# EAGLE design badger (EAGLE 7.4.0)
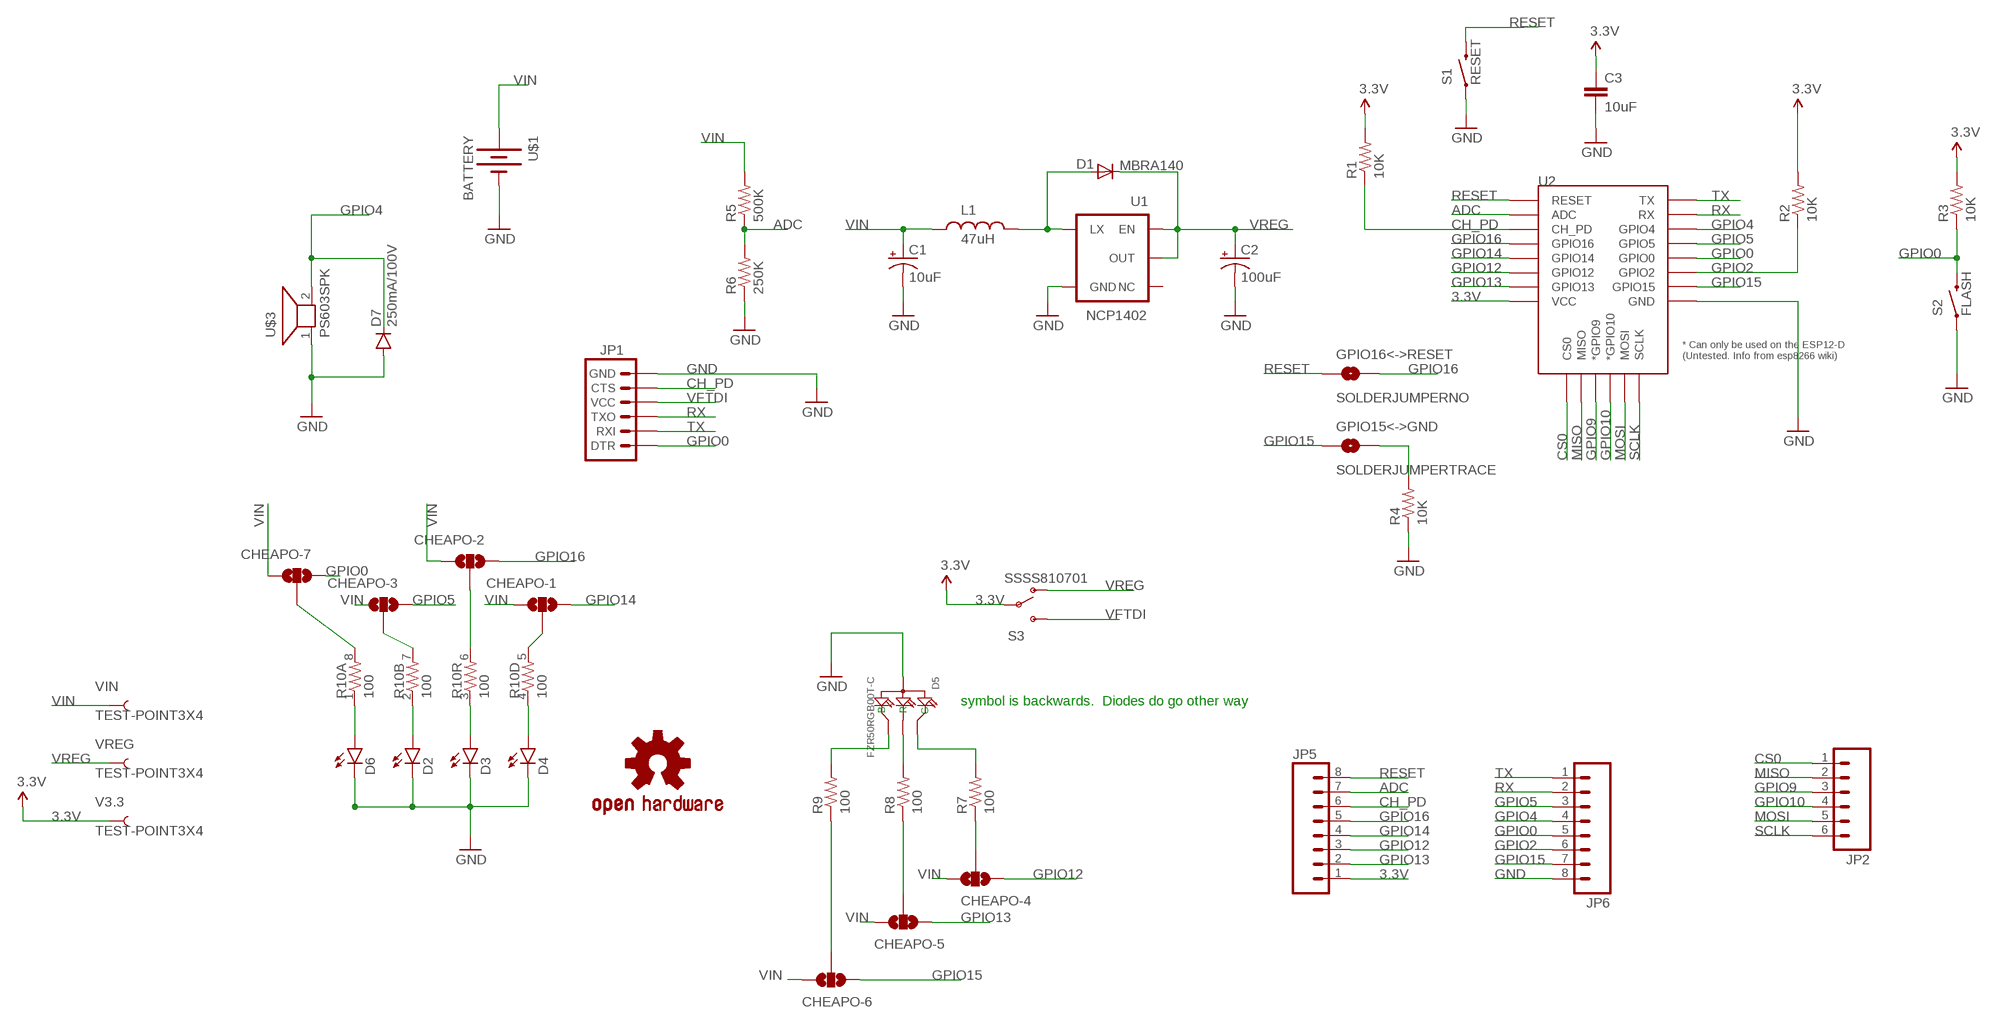
[diagram p0: schematic, sheet 1]

## Parts
C1  10uF  CAP_POL1206  [EIA3216]
C2  100uF  CAP_POL3528  [EIA3528]
C3  10uF  10UF-6.3V-20%(0603)  [0603-CAP]
CHEAPO-1  SOLDERJUMPER_2WAYT  [SJ_2]
CHEAPO-2  SOLDERJUMPER_2WAYT  [SJ_2]
CHEAPO-3  SOLDERJUMPER_2WAYT  [SJ_2]
CHEAPO-4  SOLDERJUMPER_2WAYT  [SJ_2]
CHEAPO-5  SOLDERJUMPER_2WAYT  [SJ_2]
CHEAPO-6  SOLDERJUMPER_2WAYT  [SJ_2]
CHEAPO-7  SOLDERJUMPER_2WAYT  [SJ_2]
D1  MBRA140  DIODESMA  [SMA-DIODE]
D2  LED-3MM-NO_SILK  [LED3MM-NS]
D3  LED-3MM-NO_SILK  [LED3MM-NS]
D4  LED-3MM-NO_SILK  [LED3MM-NS]
D5  FZR50RGB00T-C  DIP-LED-RGB-COMMON-ANODE(4P-D5MM)  [LED4-1.3-D5.0MM]
D6  LED-3MM-NO_SILK  [LED3MM-NS]
D7  250mA/100V  DIODEBAS16  [SOD-323]
GPIO15<->GND  SOLDERJUMPERTRACE  [SJ_2S-TRACE]
GPIO16<->RESET  SOLDERJUMPERNO  [SJ_2S-NO]
JP1  ARDUINO_SERIAL_PROGRAMLOCK  [1X06_LOCK]
JP2  M06LOCK  [1X06_LOCK]
JP5  M08LOCK  [1X08_LOCK]
JP6  M08LOCK  [1X08_LOCK]
L1  47uH  INDUCTORCR54  [CR54]
LOGO1  OSHW-LOGOL-COPPER  [OSHW-LOGO-L_COPPER]
R1  10K  10KOHM-1/10W-1%(0603)0603  [0603-RES]
R2  10K  10KOHM-1/10W-1%(0603)0603  [0603-RES]
R3  10K  10KOHM-1/10W-1%(0603)0603  [0603-RES]
R4  10K  10KOHM-1/10W-1%(0603)0603  [0603-RES]
R5  500K  RESISTOR0603  [0603-RES]
R6  250K  RESISTOR0603  [0603-RES]
R7  100  RESISTOR1206  [1206]
R8  100  RESISTOR1206  [1206]
R9  100  RESISTOR1206  [1206]
R10  100  RESISTOR-ARRAY0603-ARV  [0603-ARV]
S1  RESET  SWITCH-MOMENTARY-2SMD  [TACTILE-SWITCH-SMD]
S2  FLASH  SWITCH-MOMENTARY-2SMD  [TACTILE-SWITCH-SMD]
S3  SSSS810701  [SSSS8]
U1  NCP1402  V_REG_NCP1400SOT23-5  [SOT23-5]
U2  ESP12ESMD  [ESP12E-SMD]
U$1  BATTERY  [HOLDER]
U$3  PS603SPK  [PS603]
V3.3  TEST-POINT3X4  [PAD.03X.04]
VIN  TEST-POINT3X4  [PAD.03X.04]
VREG  TEST-POINT3X4  [PAD.03X.04]

## Nets
3.3V: C3.1 JP5.1 R1.2 R2.2 R3.2 S3.P$2(P) U2.VCC V3.3.P$1
ADC: JP5.7 R5.1 R6.2 U2.ADC
CH_PD: JP1.5(CTS) JP5.6 R1.1 U2.CH_PD
CS0: JP2.1 U2.CS0
GND: C1.C(-) C2.C(-) C3.2 D2.K(C) D3.K(C) D4.K(C) D5.C(+) D6.K(C) D7.A JP1.6(GND) JP6.8 R4.1 R6.1 S1.1 S2.1 U1.4(GND) U2.GND U$1.P$2(-) U$3.1
GPIO0: CHEAPO-7.3 JP1.1(DTR) JP6.5 R3.1 S2.3 U2.GPIO0
GPIO2: JP6.6 R2.1 U2.GPIO2
GPIO4: D7.C JP6.4 U2.GPIO4 U$3.2
GPIO5: CHEAPO-3.3 JP6.3 U2.GPIO5
GPIO9: JP2.3 U2.GPIO9(*GPIO9)
GPIO10: JP2.4 U2.GPIO10(*GPIO10)
GPIO12: CHEAPO-4.1 JP5.3 U2.GPIO12
GPIO13: CHEAPO-5.1 JP5.2 U2.GPIO13
GPIO14: CHEAPO-1.3 JP5.4 U2.GPIO14
GPIO15: CHEAPO-6.1 GPIO15<->GND.1 JP6.7 U2.GPIO15
GPIO16: CHEAPO-2.3 GPIO16<->RESET.2 JP5.5 U2.GPIO16
MISO: JP2.2 U2.MISO
MOSI: JP2.5 U2.MOSI
N$1: GPIO15<->GND.2 R4.2
N$2: D5.R R8.2
N$3: D1.A L1.P$2 U1.5(LX)
N$4: D5.G R7.2
N$5: D2.A R10.2
N$6: D3.A R10.3
N$7: D4.A R10.4
N$8: D5.B R9.2
N$9: CHEAPO-4.2 R7.1
N$11: D6.A R10.1
N$12: CHEAPO-5.2 R8.1
N$13: CHEAPO-3.2 R10.7
N$14: CHEAPO-2.2 R10.6
N$15: CHEAPO-1.2 R10.5
N$16: CHEAPO-7.2 R10.8
N$17: CHEAPO-6.2 R9.1
RESET: GPIO16<->RESET.1 JP5.8 S1.3 U2.RESET
RX: JP1.3(TXO) JP6.2 U2.RXD0(RX)
SCLK: JP2.6 U2.SCLK
TX: JP1.2(RXI) JP6.1 U2.TXD0(TX)
VFTDI: JP1.4(VCC) S3.P$1(S)
VIN: C1.A(+) CHEAPO-1.1 CHEAPO-2.1 CHEAPO-3.1 CHEAPO-4.3 CHEAPO-5.3 CHEAPO-6.3 CHEAPO-7.1 L1.P$1 R5.2 U$1.P$1(+) VIN.P$1
VREG: C2.A(+) D1.C S3.P$3(O) U1.1(EN) U1.2(OUT) VREG.P$1
Unconnected: U1.3(NC)

## Notes on the sheet
- symbol is backwards.  Diodes do go other way

## Library data of the parts
C1 C2 = SparkFun:CAP_POL: Capacitor Polarized These are standard SMD and PTH capacitors. Normally 10uF, 47uF, and 100uF in electrolytic and tantalum varieties. Always verify the external diameter of the through hole cap, it varies with capacity, voltage, and manufacturer. The EIA devices should be standard.
C3 = SparkFun-Capacitors:10UF-6.3V-20%(0603): CAP-11015; PROD_ID: CAP-11015
CHEAPO-1-CHEAPO-7 = SparkFun-Retired:SOLDERJUMPER_2WAY: Solder Jumper 2 way solder jumper
D1 = SparkFun:DIODE: Diode These are standard reverse protection diodes and small signal diodes. SMA package can handle up to about 1A. SOD-323 can handle about 200mA. What the SOD-323 package when ordering, there are some mfgs out there that are 5-pin packages.
D2-D4 D6 = SparkFun-LED:LED: LEDs Standard schematic elements and footprints for 5mm, 3mm, 1206, and 0603 sized LEDs. 5mm - Spark Fun Electronics SKU : COM-00529 (and others)
D5 = Seeed-OPL-Diode:DIP-LED-RGB-COMMON-ANODE(4P-D5MM): 304090056; MPN: FZR50RGB00T-C
D7 = SparkFun-DiscreteSemi:DIODE: Diode These are standard reverse protection diodes and small signal diodes. SMA package can handle up to about 1A. SOD-323 can handle about 200mA. What the SOD-323 package when ordering, there are some mfgs out there that are 5-pin packages.; PROD_ID: DIO-09646
GPIO15<->GND GPIO16<->RESET = SparkFun-Retired:SOLDERJUMPER: Solder Jumper Standard SMD solder jumper. Used to automate production. Two varients : Normally Open and Normally Closed are the same, but have different paste layers. NC will have a large amount of paste and should jumper during reflow.
JP1 = SparkFun-Connectors:ARDUINO_SERIAL_PROGRAM: FTDI connector footprints
JP2 = SparkFun-Connectors:M06: Header 6 Standard 6-pin 0.1" header. Use with straight break away headers (SKU : PRT-00116), right angle break away headers (PRT-00553), swiss pins (PRT-00743), machine pins (PRT-00117), and female headers (PRT-00115). Molex polarized connector foot print use with SKU : PRT-08094 with associated crimp pins and housings. NOTES ON THE VARIANTS LOCK and LOCK_LONGPADS... This footprint was designed to help hold the alignment of a through-hole component (i.e. 6-pin header) while soldering it into place. You may notice that each hole has been shifted either up or down by 0.005 of an inch from it's more standard position (which is a perfectly straight line). This slight alteration caused the pins (the squares in the middle) to touch the edges of the holes. Because they are alternating, it causes a "brace" to hold the component in place. 0.005 has proven to be the perfect amount of "off-center" position when using our standard breakaway headers. Although looks a little odd when you look at the bare footprint, once you have a header in there, the alteration is very hard to notice. Also,if you push a header all the way into place, it is covered up entirely on the bottom side. This idea of altering the position of holes to aid alignment will be further integrated into the Sparkfun Library for other footprints. It can help hold any component with 3 or more connection pins.
JP5 JP6 = SparkFun-Connectors:M08: Header 8 Standard 8-pin 0.1" header. Use with straight break away headers (SKU : PRT-00116), right angle break away headers (PRT-00553), swiss pins (PRT-00743), machine pins (PRT-00117), and female headers (PRT-00115).
L1 = SparkFun:INDUCTOR: Inductors Basic Inductor/Choke - 0603 and 1206. Footprints are not proven and vary greatly between part numbers.
LOGO1 = SparkFun-Aesthetics:OSHW-LOGO: Open Source Hardware Logo This logo indicates the piece of hardware it is found on incorporates a OSHW license and/or adheres to the definition of open source hardware found here: http://freedomdefined.org/OSHW
R1-R4 = SparkFun-Resistors:10KOHM-1/10W-1%(0603): RES-00824; PROD_ID: RES-00824
R5-R9 = SparkFun-Resistors:RESISTOR: Resistor Basic schematic elements and footprints for 0603, 1206, and PTH resistors.
R10 = SparkFun-Resistors:RESISTOR-ARRAY: Array Chip Resistor Source: RS Component / Phycomp
S1 S2 = SparkFun-Electromechanical:SWITCH-MOMENTARY-2: Various NO switches- pushbuttons, reed, etc; PROD_ID: SWCH-08247
S3 = badger:SSSS810701: ALSP SSSS810701
U1 = SparkFun:V_REG_NCP1400: Switching step-up voltage regulator NCP1400 switiching regulator takes single cell AA and outputs 100mA at 3.3V or 5V with minimal number of external components.
U2 = esp8266modules:ESP12E: ESP12E Module
U$1 = badger:BATTERY
U$3 = adafruit:PS603: PS603 Small 8 ohm speaker, from Mouser. Can SMT solder to board http://www.ladyada.net/library/pcb/eaglelibrary.html
V3.3 VIN VREG = SparkFun-Passives:TEST-POINT: Bare copper test points for troubleshooting or ICT

## Board
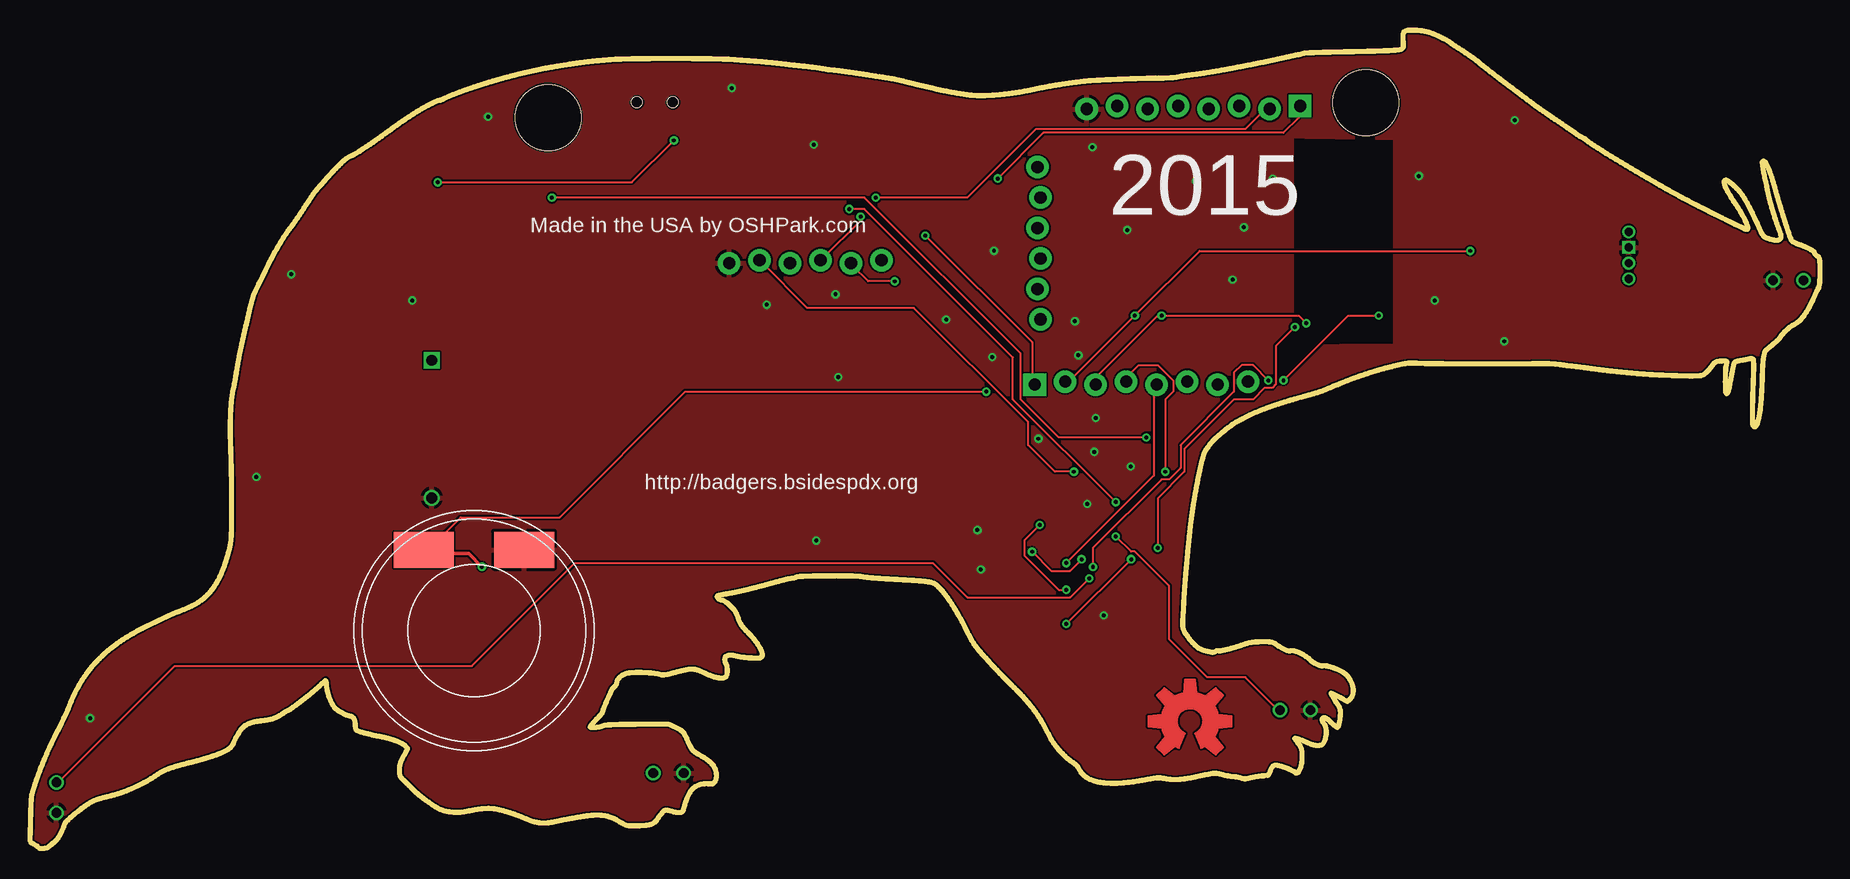
[diagram p1: board, top side]
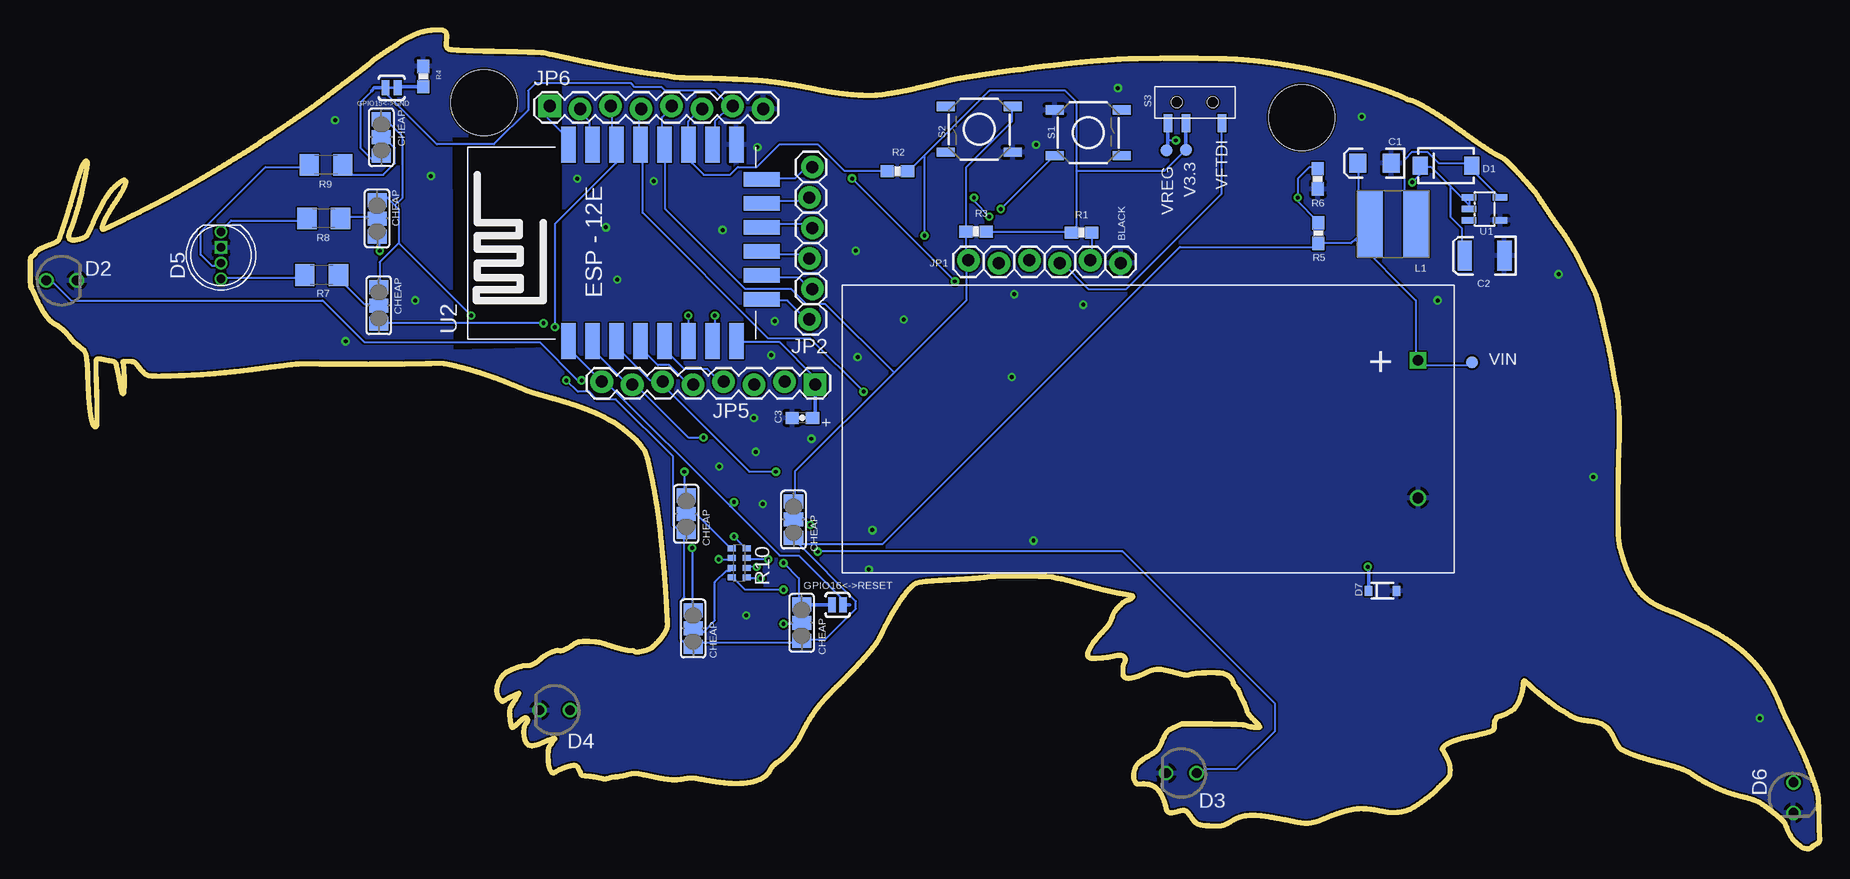
[diagram p2: board, bottom side, seen from below]

Size 149.15 x 68.26 mm. Coordinates in mm from the lower left corner, seen from the top.
Outline: 5234 segments
Copper layers (1*16): Top 0.0356mm / dielectric 1.5011mm / Bottom 0.0356mm
Design rules "oshpark-2layer *": minimum track width 6mil, minimum drill 13mil, track to track 6mil, track to pad 6mil, pad to pad 6mil, via to via 6mil, smd to smd 6mil, copper to edge 6mil, drill to drill 6mil, minimum pad ring 7mil, minimum via ring 7mil, stop-mask expansion 4mil, vias tented up to drill 25mil, thermal gap 10mil
Holes 5.5 mm at 43.18,60.96 111.31,62.2

### Footprints (pad centres in the part's own frame; a part is rotated, then mirrored left to right if it is on the bottom)
EIA3216 = smd 1.4 x 1.6: A 1.4,0; C -1.4,0
EIA3528 = smd 1.2 x 2.5: A 1.65,0; C -1.65,0
0603-CAP = smd 1.1 x 1: 1 -0.85,0; 2 0.85,0
SJ_2 = smd 1.168 x 1.6: 1 -1.524,0; 2 0,0; 3 1.524,0
SMA-DIODE = smd 1.27 x 1.47: A -2.15,0; C 2.15,0
LED3MM-NS = drill 0.813: A -1.27,0; K 1.27,0
LED4-1.3-D5.0MM = drill 0.7 pad 1: B -0.65,0; G -1.95,0; R 1.95,0 | drill 0.7 pad 1 square: C 0.65,0
SOD-323 = smd 0.63 x 0.83: A 1.15,0; C -1.15,0
SJ_2S-TRACE = smd 0.635 x 1.27: 1 -0.508,0; 2 0.508,0
SJ_2S-NO = smd 0.635 x 1.27: 1 -0.45,0; 2 0.45,0
1X06_LOCK = drill 1.016 pad 1.88: 1 0,0; 2 2.54,-0.254; 3 5.08,0; 4 7.62,-0.254; 5 10.16,0; 6 12.7,-0.254
1X08_LOCK = drill 1.016 pad 1.88 square: 1 0,0.127 | drill 1.016 pad 1.88: 2 2.54,-0.127; 3 5.08,0.127; 4 7.62,-0.127; 5 10.16,0.127; 6 12.7,-0.127; 7 15.24,0.127; 8 17.78,-0.127
CR54 = smd 5.5 x 2.15: P$1 0,1.92; P$2 0,-1.92
0603-RES = smd 1.1 x 1: 1 -0.85,0; 2 0.85,0
1206 = smd 1.6 x 1.8: 1 -1.4,0; 2 1.4,0
0603-ARV = smd 0.5 x 0.65: 1 -1.2,-0.625; 2 -0.4,-0.625; 3 0.4,-0.625; 4 1.2,-0.625; 5 1.2,0.625; 6 0.4,0.625; 7 -0.4,0.625; 8 -1.2,0.625
TACTILE-SWITCH-SMD = smd 1.524 x 0.762: 1 -2.794,1.905; 2 2.794,1.905; 3 -2.794,-1.905; 4 2.794,-1.905
SSSS8 = smd 0.7 x 1.5: P$1 -2.25,1.75; P$2 0.75,1.75; P$3 2.25,1.75 | hole 0.9: -1.5,0; 1.5,0
SOT23-5 = smd 0.55 x 1.2: 1 -0.95,-1.3; 2 0,-1.3; 3 0.95,-1.3; 4 0.95,1.3; 5 -0.95,1.3
ESP12E-SMD = smd 3 x 1.2: ADC -8.3,3.8; CH_PD -8.3,1.8; GND 8.1,-8.2; GPIO0 8.1,-2.2; GPIO2 8.1,-4.2; GPIO4 8.1,-0.2; GPIO5 8.1,1.8; GPIO12 -8.3,-4.2; GPIO13 -8.3,-6.2; GPIO14 -8.3,-2.2; GPIO15 8.1,-6.2; GPIO16 -8.3,-0.2; RESET -8.3,5.8; RXD0 8.1,3.8; TXD0 8.1,5.8; VCC -8.3,-8.2 | smd 1.2 x 3: CS0 -4.8,-10.3; GPIO9 -0.8,-10.3; GPIO10 1.2,-10.3; MISO -2.8,-10.3; MOSI 3.2,-10.3; SCLK 5.2,-10.3
HOLDER = drill 0.9 square: P$1 3,6.265 | drill 0.9: P$2 3,17.735
PS603 = smd 5 x 3: 1 -4.184,-6.738; 2 4.184,-6.738
PAD.03X.04 = smd 1.016 x 1.016: P$1 0,0

### Placement (x,y rotation side)
C1  37.12,57.16 180 bottom
C2  27.94,49.43 180 bottom
C3  84.79,35.92 180 bottom
CHEAPO-1  94.47,27.92 90 bottom
CHEAPO-2  84.84,18.84 90 bottom
CHEAPO-3  93.89,18.35 90 bottom
CHEAPO-4  120.09,45.3 90 bottom
CHEAPO-5  120.22,52.55 90 bottom
CHEAPO-6  119.88,59.31 90 bottom
CHEAPO-7  85.52,27.43 90 bottom
D1  31.16,56.96 180 bottom
D2  146.53,47.38 0 bottom
D3  53.2,6.3 180 bottom
D4  105.43,11.55 180 bottom
D5  133.23,49.48 90 bottom
D6  2.2,4.26 270 bottom
D7  36.44,21.5 0 bottom
GPIO15<->GND  119.02,63.44 0 bottom
GPIO16<->RESET  81.86,20.32 180 bottom
JP1  70.96,49.07 0 bottom
JP2  84.21,44.13 90 bottom
JP5  83.73,38.82 180 bottom
JP6  105.84,61.81 0 bottom
L1  35.56,52.07 90 bottom
LOGO1  96.67,10.62 0 top
R1  61.52,51.38 180 bottom
R2  76.87,56.49 0 bottom
R3  70.3,51.47 0 bottom
R4  116.39,64.38 270 bottom
R5  41.8,51.33 270 bottom
R6  41.83,55.86 90 bottom
R7  124.85,47.83 180 bottom
R8  124.68,52.56 180 bottom
R9  124.48,57.02 180 bottom
R10  90.06,23.83 90 bottom
S1  60.96,59.69 0 bottom
S2  70.04,59.98 180 bottom
S3  52.07,62.23 180 bottom
U1  27.94,53.34 270 bottom
U2  98.48,50.61 90 bottom
U$1  30.48,46.99 180 bottom
U$3  36.99,18.18 180 top
V3.3  52.82,58.27 0 bottom
VIN  28.97,40.54 0 bottom
VREG  54.46,58.22 0 bottom

### Tracks (layer width: path | path; a pad name or v marks a point on that pad's centre or on a via)
3.3V  (via drill 0.33)
  Top 0.152: v74.61,51.12 83.5,42.23 83.5,38.73 JP5.1
  Bottom 0.152: U2.VCC 90.17,42.23 86.68,42.23 83.82,39.37 83.82,38.73 JP5.1 | R3.2 69.22,51.44 62.55,51.44 R1.2 62.23,51.44 61.91,51.75 61.91,56.52 | 74.61,57.78 69.22,63.18 62.87,63.18 61.91,62.23 61.91,56.52 | 74.61,57.78 75.88,56.52 R2.2 | 61.91,56.52 54.61,56.52 53.02,58.1 V3.3.P$1 | 74.61,57.78 v74.61,51.12
  Bottom 0.305: S3.P$2 V3.3.P$1 | JP5.1 83.73,36.14 C3.1
ADC  (via drill 0.33)
  Top 0.152: v43.5,54.29 69.53,54.29 82.55,41.27 82.55,37.47 85.72,34.29 v93.03,34.29
  Bottom 0.152: R5.1 41.91,52.39 43.5,53.98 v43.5,54.29 43.5,55.88 42.55,56.83 41.91,56.83 R6.2 | v93.03,34.29 94.3,34.29 98.74,38.73 JP5.7 99.06,38.42 102.23,41.59 102.23,42.23 U2.ADC
CH_PD  (via drill 0.33)
  Top 0.152: v87,31.43 85.41,31.43 83.19,33.66 83.19,35.56 73.66,45.09 64.77,45.09 60.96,48.9 JP1.5
  Bottom 0.152: R1.1 60.64,51.12 60.64,49.21 JP1.5 | U2.CH_PD 100.01,42.23 100.01,41.59 97.47,39.05 96.52,39.05 JP5.6 96.52,38.73 89.22,31.43 v87,31.43
CS0
  Bottom 0.152: U2.CS0 87.95,45.72 86.04,45.72 84.45,44.13 JP2.1
GND  (via drill 0.33)
  other vias: 5.01,10.89 18.87,30.99 21.77,47.89 31.86,45.72 38.17,61.03 58.49,63.42 65.31,58.71 80.33,49.85 67.13,46.23 61.39,45.35 76.34,44.12 80.19,41 87.08,43.98 87.08,43.98 87.37,41.15 100.22,47.46 101.16,51.81 91.44,51.6 88.53,58.49 97.17,55.66 103.55,55.88 115.75,56.09 123.73,60.74 117.05,45.72 122.86,42.31 88.82,35.92 61.39,45.35 65.53,25.69 78.95,26.56 79.24,23.29 88.1,28.74 91.73,31.86 88.68,33.09 84.03,34.18 89.48,19.45 67.34,39.33
  pour Bottom: -5.99,79.57 -5.99,-12.07 114.92,-12.07 114.92,34.38 104.59,34.38 104.59,68.08 15.93,68.08 15.74,79.96
  pour Bottom: 102.67,70.31 103.19,59.51 114.18,59.48 114.09,41.45 106.9,41.62 103.52,42.15 104.39,39.69 104.39,29.84 152.78,29.84 152.78,66.15
  pour Top: -10.04,76 105.14,71.68 105.06,33 117.04,32.83 117.04,-9.75 -24.82,-9.75 -24.82,72.14 -10.04,72.14
  pour Top: 102.08,77.84 103.46,77.5 103.71,59.46 113.76,59.29 113.76,41.91 104.48,41.83 104.48,30.82 152,30.9 152,78.13 109.51,78.13 109.51,83.53 102.08,83.53
GPIO0
  Bottom 0.152: JP6.5 95.57,61.91 96.52,60.96 96.52,58.74 U2.GPIO0 96.2,58.42 96.2,53.34 89.53,46.67 85.72,46.67 84.45,45.4 82.87,45.4 77.15,39.69 | S2.3 67.31,61.59 67.31,60.64 71.12,56.83 71.12,51.75 R3.1 71.12,51.44 71.12,49.21 JP1.1 71.12,48.9 71.12,45.72 77.15,39.69 | 77.15,39.69 85.41,31.43 85.41,29.21 CHEAPO-7.3
GPIO2
  Bottom 0.152: R2.1 77.79,56.52 81.28,56.52 83.5,58.74 86.68,58.74 88.58,56.83 90.17,56.83 90.81,56.2 93.03,56.2 93.98,57.15 93.98,58.42 U2.GPIO2 94.3,58.74 94.3,60.64 93.34,61.59 JP6.6
GPIO4  (via drill 0.33)
  Top 0.152: v79.69,38.1 54.61,38.1 44.13,27.62 35.88,27.62 33.52,25.26 33.02,24.77 U$3.2
  Top 0.305: 34.25,24.53 34.18,24.6 | 33.52,25.26 33.96,24.82 34.18,24.6 | v37.66,23.51 36.57,24.6 34.18,24.6
  Bottom 0.152: JP6.4 98.42,61.59 98.42,58.74 U2.GPIO4 98.11,58.42 98.11,53.02 87.63,42.55 84.14,42.55 v79.69,38.1
  Bottom 0.305: D7.C 37.59,23.44 v37.66,23.51
GPIO5  (via drill 0.33)
  Top 0.152: v93.98,25.08 93.98,29.21 96.2,31.43 96.2,33.34 100.33,37.47 101.92,37.47 102.87,38.42 103.5,38.42 103.82,38.73 103.82,41.91 v105.41,43.5
  Bottom 0.152: v93.98,25.08 93.98,20 CHEAPO-3.3 | v105.41,43.5 105.41,52.07 100.33,57.15 100.33,58.42 U2.GPIO5 100.33,58.74 100.65,59.05 100.65,61.91 JP6.3
GPIO9
  Bottom 0.152: U2.GPIO9 87.95,49.53 84.45,49.53 JP2.3
GPIO10
  Bottom 0.152: U2.GPIO10 87.95,52.07 84.14,52.07 JP2.4
GPIO12  (via drill 0.33)
  Top 0.152: v106.36,43.81 105.73,44.45 v94.3,44.45 93.98,44.45 88.9,39.37 88.9,38.73 JP5.3
  Bottom 0.152: v106.36,43.81 120.02,43.81 CHEAPO-4.1 | v94.3,44.45 94.3,42.55 U2.GPIO12
GPIO13  (via drill 0.33)
  Top 0.152: v120.02,49.85 97.47,49.85 v92.08,44.45 86.36,38.73 JP5.2
  Bottom 0.152: v120.02,49.85 120.02,50.8 CHEAPO-5.1 | v92.08,44.45 92.08,42.55 U2.GPIO13
GPIO14  (via drill 0.33)
  Top 0.152: v94.61,31.43 94.61,37.47 95.25,38.1 95.25,39.05 93.98,40.32 92.39,40.32 91.12,39.05 JP5.4
  Bottom 0.152: v94.61,31.43 94.61,29.53 CHEAPO-1.3 | U2.GPIO14 96.2,42.23 96.2,41.59 94.61,40.01 92.71,40.01 91.44,38.73 JP5.4
GPIO15
  Bottom 0.152: 120.68,63.21 120.65,63.18 121.6,62.23 121.6,58.42 120.65,57.47 120.02,57.47 CHEAPO-6.1 | 90.81,61.91 92.08,60.64 92.08,58.74 U2.GPIO15 | 90.81,61.91 92.08,63.18 96.2,63.18 96.52,63.5 98.74,63.5 99.06,63.82 107,63.82 107.63,63.18 107.63,61.59 110.49,58.74 115.25,58.74 119.7,63.18 GPIO15<->GND.1 | 90.81,61.91 JP6.7
  Bottom 0.305: GPIO15<->GND.1 120.44,63.44 120.68,63.21
GPIO16  (via drill 0.33)
  Top 0.152: v86.36,23.81 93.66,31.11 93.66,38.42 JP5.5
  Bottom 0.152: v86.36,23.81 85.09,22.54 85.09,20.64 CHEAPO-2.3 | U2.GPIO16 98.11,42.23 98.11,41.59 96.84,40.32 95.89,40.32 93.98,38.42 JP5.5
  Bottom 0.305: GPIO16<->RESET.2 84.8,20.32 CHEAPO-2.3
MISO
  Bottom 0.152: U2.MISO 87.95,47.62 85.09,47.62 84.14,46.67 JP2.2
MOSI
  Bottom 0.152: U2.MOSI 87.95,53.98 84.77,53.98 84.45,54.29 JP2.5
N$1
  Bottom 0.305: R4.2 118.42,63.52 GPIO15<->GND.2
N$2
  Bottom 0.152: R8.2 126.36,52.39 132.4,52.39 133.35,51.44 D5.R
N$3
  Bottom 0.152: U1.5 26.67,54.29 29.21,56.83 D1.A 29.21,57.15 31.75,57.15 32.7,58.1 33.97,58.1 34.61,57.47 34.61,53.02 33.66,52.07 L1.P$2
N$4
  Bottom 0.152: R7.2 126.36,47.62 133.03,47.62 D5.G
N$5  (via drill 0.33)
  Top 0.152: v88.58,23.5 88.58,25.08 94.3,30.8 94.93,30.8 95.89,31.75 95.89,33.66 100.33,38.1 100.33,39.69 100.97,40.32 101.92,40.32 v103.19,39.05
  Bottom 0.152: v88.58,23.5 89.22,23.5 R10.2 | v103.19,39.05 103.5,39.05 106.68,42.23 121.28,42.23 124.78,45.72 145.73,45.72 147.64,47.62 D2.A
N$6  (via drill 0.33)
  Top 0.152: v87.63,24.13 86.68,23.18 85.09,23.18 v83.5,24.77
  Bottom 0.152: v87.63,24.13 89.22,24.13 R10.3 | v83.5,24.77 58.1,24.77 45.4,12.06 45.4,9.84 48.58,6.67 51.12,6.67 51.75,6.03 D3.A
N$7  (via drill 0.33)
  Top 0.152: v90.49,26.04 91.76,24.77 92.08,24.77 94.93,21.91 94.93,17.46 98.11,14.29 101.28,14.29 104.14,11.43 D4.A
  Bottom 0.152: v90.49,26.04 89.53,25.08 R10.4
N$8
  Bottom 0.152: R9.2 126.05,56.83 129.54,56.83 134.94,51.44 134.94,49.53 133.99,48.58 133.35,48.58 D5.B
N$9
  Bottom 0.152: CHEAPO-4.2 120.33,45.4 121.28,45.4 123.51,47.62 R7.1
N$11  (via drill 0.33)
  Top 0.152: v88.27,22.54 86.68,20.95 78.11,20.95 75.25,23.81 45.4,23.81 36.83,15.24 12.06,15.24 2.22,5.4 D6.A
  Bottom 0.152: v88.27,22.54 89.22,22.54 R10.1
N$12
  Bottom 0.152: CHEAPO-5.2 120.33,52.7 123.19,52.7 R8.1
N$13
  Bottom 0.152: R10.7 90.81,23.18 91.12,23.18 92.08,22.23 92.08,19.05 93.03,18.1 93.66,18.1 CHEAPO-3.2
N$14  (via drill 0.33)
  Top 0.152: v86.36,18.73 v91.76,24.13
  Bottom 0.152: v91.76,24.13 90.81,24.13 R10.6 | v86.36,18.73 85.09,18.73 CHEAPO-2.2
N$15
  Bottom 0.152: R10.5 90.81,25.08 93.66,27.94 94.3,27.94 CHEAPO-1.2
N$16  (via drill 0.33)
  Top 0.152: v86.36,21.59 85.72,21.59 82.87,24.45 82.87,25.72 v84.14,26.99
  Bottom 0.152: v86.36,21.59 89.53,21.59 90.49,22.54 R10.8 | v84.14,26.99 84.77,27.62 85.41,27.62 CHEAPO-7.2
N$17
  Bottom 0.152: CHEAPO-6.2 119.7,59.05 119.38,59.05 118.75,58.42 118.75,57.15 119.7,56.2 122.24,56.2 122.87,56.83 R9.1
RESET  (via drill 0.33)
  Top 0.152: v68.26,53.34 69.53,53.34 81.92,40.96 81.92,37.47 v90.49,28.89
  Bottom 0.152: 90.81,28.57 101.28,39.05 JP5.8 101.6,39.05 104.14,41.59 104.14,42.23 U2.RESET | 90.81,28.57 86.68,24.45 85.09,24.45 81.6,20.95 81.6,20.32 GPIO16<->RESET.1 | v68.26,53.34 63.82,57.78 S1.3 | 90.81,28.57 v90.49,28.89
  Bottom 0.305: GPIO16<->RESET.1 80.84,20.32
RX  (via drill 0.33)
  Top 0.152: v69.22,52.7 69.22,52.39 66.04,49.21 JP1.3 | v70.48,54.29 78.11,54.29 83.82,60.01 101.28,60.01 103.19,61.91 JP6.2
  Bottom 0.152: U2.RXD0 102.55,58.74 102.55,60.64 103.5,61.59 JP6.2 | v69.22,52.7 70.48,53.98 v70.48,54.29
SCLK
  Bottom 0.152: U2.SCLK 87.95,55.88 85.41,55.88 84.14,57.15 JP2.6
TX  (via drill 0.33)
  Top 0.152: v72.07,47.31 69.85,47.31 68.58,48.58 JP1.2 | v80.64,55.88 84.45,59.69 104.46,59.69 105.73,60.96 105.73,61.91 JP6.1
  Bottom 0.152: U2.TXD0 104.46,58.74 104.46,59.37 106.05,60.96 106.05,61.91 JP6.1 | v80.64,55.88 v72.07,47.31
VFTDI
  Bottom 0.152: S3.P$1 49.85,60.33 49.85,54.61 57.78,46.67 60.96,46.67 63.18,48.9 JP1.4
VIN  (via drill 0.33)
  Top 0.152: v112.39,44.45 109.86,44.45 v104.46,39.05
  Bottom 0.152: VIN.P$1 29.21,40.32 33.02,40.32 33.34,40.64 U$1.P$1 33.66,40.96 33.66,45.72 38.73,50.8 | 38.42,51.12 37.47,52.07 L1.P$1 38.42,51.12 | 38.42,51.12 38.73,50.8 | 38.73,50.8 39.05,50.48 41.59,50.48 R5.2 41.91,50.16 53.34,50.16 78.11,25.4 85.09,25.4 | 38.42,51.12 38.42,57.15 C1.A | 118.43,50.48 120.02,48.9 120.02,46.99 CHEAPO-4.3 | 118.43,50.48 118.43,53.34 118.75,53.66 | 118.75,53.66 119.38,54.29 120.02,54.29 CHEAPO-5.3 | 118.75,53.66 118.11,54.29 118.11,59.37 119.38,60.64 119.7,60.64 CHEAPO-6.3 | 85.09,25.4 80.33,20.64 80.33,20 82.87,17.46 84.77,17.46 CHEAPO-2.1 85.09,17.14 93.66,17.14 CHEAPO-3.1 93.98,17.14 94.61,17.14 94.93,17.46 94.93,20.64 94.61,20.95 94.61,26.04 | 85.09,25.4 85.41,25.72 CHEAPO-7.1 85.09,25.4 | 94.61,26.04 94.61,26.35 CHEAPO-1.1 94.61,26.04 | v112.39,44.45 118.43,50.48 | v104.46,39.05 103.5,38.1 102.55,38.1 101.92,37.47 100.33,37.47 95.57,32.7 95.57,26.99 94.61,26.04
VREG  (via drill 0.33)
  Top 0.152: v53.66,59.05 50.16,55.56 v33.97,55.56
  Bottom 0.152: 29.21,53.66 29.21,54.29 U1.1 | 29.21,53.66 29.21,53.34 U1.2 | 32.7,56.83 32.38,56.83 30.8,55.24 | 32.7,56.83 33.02,56.83 D1.C 32.7,56.83 | 29.21,53.66 30.8,55.24 | v53.66,59.05 54.32,59.05 | 32.7,56.83 v33.97,55.56 | 30.8,55.24 30.8,52.7 29.84,51.75 29.84,49.53 C2.A
  Bottom 0.305: S3.P$3 54.32,59.05 54.32,58.36 VREG.P$1

### Text on the board
tNames: 2015 | Made in the USA by OSHPark.com | http://badgers.bsidespdx.org
bNames: CHEAP | VFTDI | V3.3 | VREG | CHEAP | BLACK | CHEAP | VIN | + | CHEAP | CHEAP | CHEAP | CHEAP